# EAGLE design qpot (EAGLE 6.6.0)
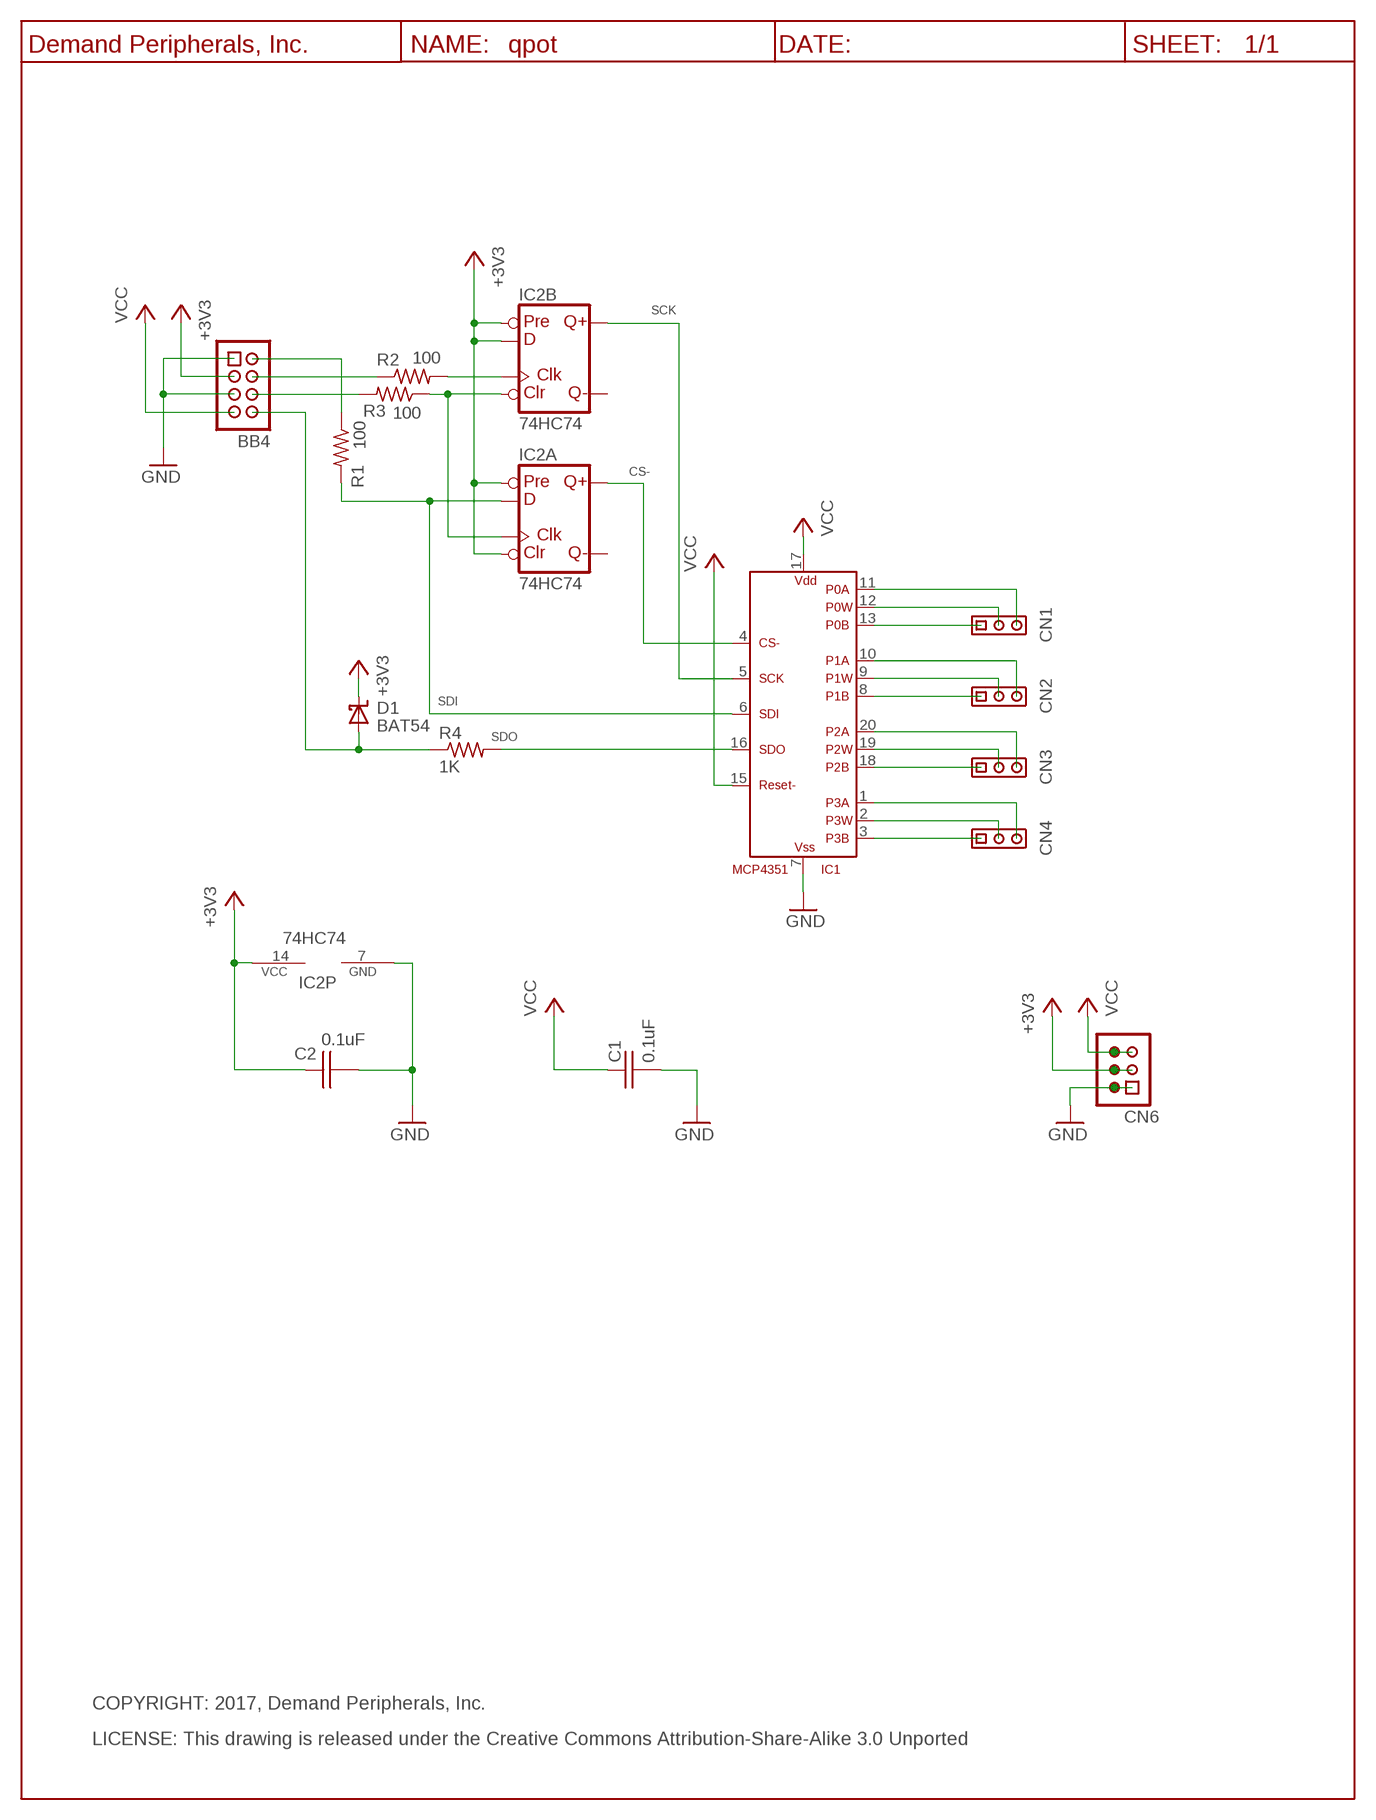
[diagram p0: schematic, sheet 1]

## Parts
BB4  BB_CON  HDR-4X2-SHR  [HDR-4X2]
C1  0.1uF  C0.1UF_C0603  [C0603]
C2  0.1uF  C0.1UF_C0603  [C0603]
CN1  HDR-3X1  [HDR-3X1]
CN2  HDR-3X1  [HDR-3X1]
CN3  HDR-3X1  [HDR-3X1]
CN4  HDR-3X1  [HDR-3X1]
CN6  HDR-3X2  [HDR-3X2]
D1  BAT54  [SOT23]
IC1  MCP4351  [TSSOP20]
IC2  74HC74  74AHC74SS  [SO14]
R1  100  R100_R0603  [R0603]
R2  100  R100_R0603  [R0603]
R3  100  R100_R0603  [R0603]
R4  1K  R1K_R0603  [R0603]
U$3  DP_FRAME_P  [P_FRAME]

## Nets
+3V3: BB4.3 C2.1 CN6.3 CN6.4 D1.3(CC) IC2.1(A:CLR) IC2.4(A:PRE) IC2.10(B:PRE) IC2.12(B:D) IC2.14(P:VCC)
GND: BB4.1 BB4.5 C1.2 C2.2 CN6.1 CN6.2 IC1.7(VSS) IC2.7(P:GND)
N$1: CN1.1 IC1.13(P0B)
N$2: CN1.2 IC1.12(P0W)
N$3: CN1.3 IC1.11(P0A)
N$4: CN2.1 IC1.8(P1B)
N$5: CN2.2 IC1.9(P1W)
N$6: CN2.3 IC1.10(P1A)
N$7: BB4.8 D1.1(A) R4.1
N$8: IC1.16(SDO) R4.2
N$13: IC2.3(A:CLK) IC2.13(B:CLR) R3.1
N$14: BB4.4 R2.1
N$15: IC1.6(SDI) IC2.2(A:D) R1.2
N$16: IC2.11(B:CLK) R2.2
N$17: CN3.1 IC1.18(P2B)
N$18: CN3.2 IC1.19(P2W)
N$19: BB4.6 R3.2
N$20: BB4.2 R1.1
N$21: CN3.3 IC1.20(P2A)
N$22: CN4.1 IC1.3(P3B)
N$23: IC1.4(CS-) IC2.5(A:Q)
N$24: IC1.5(SCK) IC2.9(B:Q)
N$25: CN4.2 IC1.2(P3W)
N$26: CN4.3 IC1.1(P3A)
VCC: BB4.7 C1.1 CN6.5 CN6.6 IC1.15(RESET-) IC1.17(VDD)
Unconnected: IC2.6(A:!Q) IC2.8(B:!Q)

## Notes on the sheet
- SCK
- CS-
- SDI
- SDO
- COPYRIGHT: 2017, Demand Peripherals, Inc.
- LICENSE: This drawing is released under the Creative Commons Attribution-Share-Alike 3.0 Unported

## Library data of the parts
BB4 = dpi-conn:HDR-4X2-SHR: Shrouded 4x2 pin header; VENDOR: Digikey; VENDOR-PART-NUM: 609-3530-ND
C1 C2 = dpi-passive:C0.1UF_: 0.1 uF Capacitor, 25V, X7R; VENDOR: Digikey; VENDOR-PART-NUM: 1276-1126-2-ND
CN1-CN4 = dpi-conn:HDR-3X1: 3 pin header on 0.1 inch centers, no shroud, no lock; VENDOR: Digikey; VENDOR-PART-NUM: 952-2264-ND
CN6 = dpi-conn:HDR-3X2: Unshrouded 3x2 header with 0.1 inch pitch; VENDOR: Digikey; VENDOR-PART-NUM: 952-2120-ND
D1 = dpi-diopto:BAT54: Schottky Diode; VENDOR: Digikey; VENDOR-PART-NUM: DB3Y313KELCT-ND
IC1 = dpi-transic:MCP4351: MCP5351: Quad 257 position 10K digital potentiometer; VENDOR: Digikey; VENDOR-PART-NUM: MCP4351-103E/ST-ND
IC2 = dpi-transic:74AHC74: Dual D type positive edge triggered FLIP FLOP, preset and clear; VENDOR: Digikey; VENDOR-PART-NUM: 568-4458-1-ND
R1-R3 = dpi-passive:R100_: 100 Ohm resistor, 1%, 0.1 watt; VENDOR: Digikey; VENDOR-PART-NUM: 311-100HRTR-ND
R4 = dpi-passive:R1K_: 1K Resistor, 1%, 0.1 watt; VENDOR: Digikey; VENDOR-PART-NUM: 311-1.00KHRTR-ND
U$3 = dpi-sym:DP_FRAME_P: Portrait/Letter Document Frame

## Board
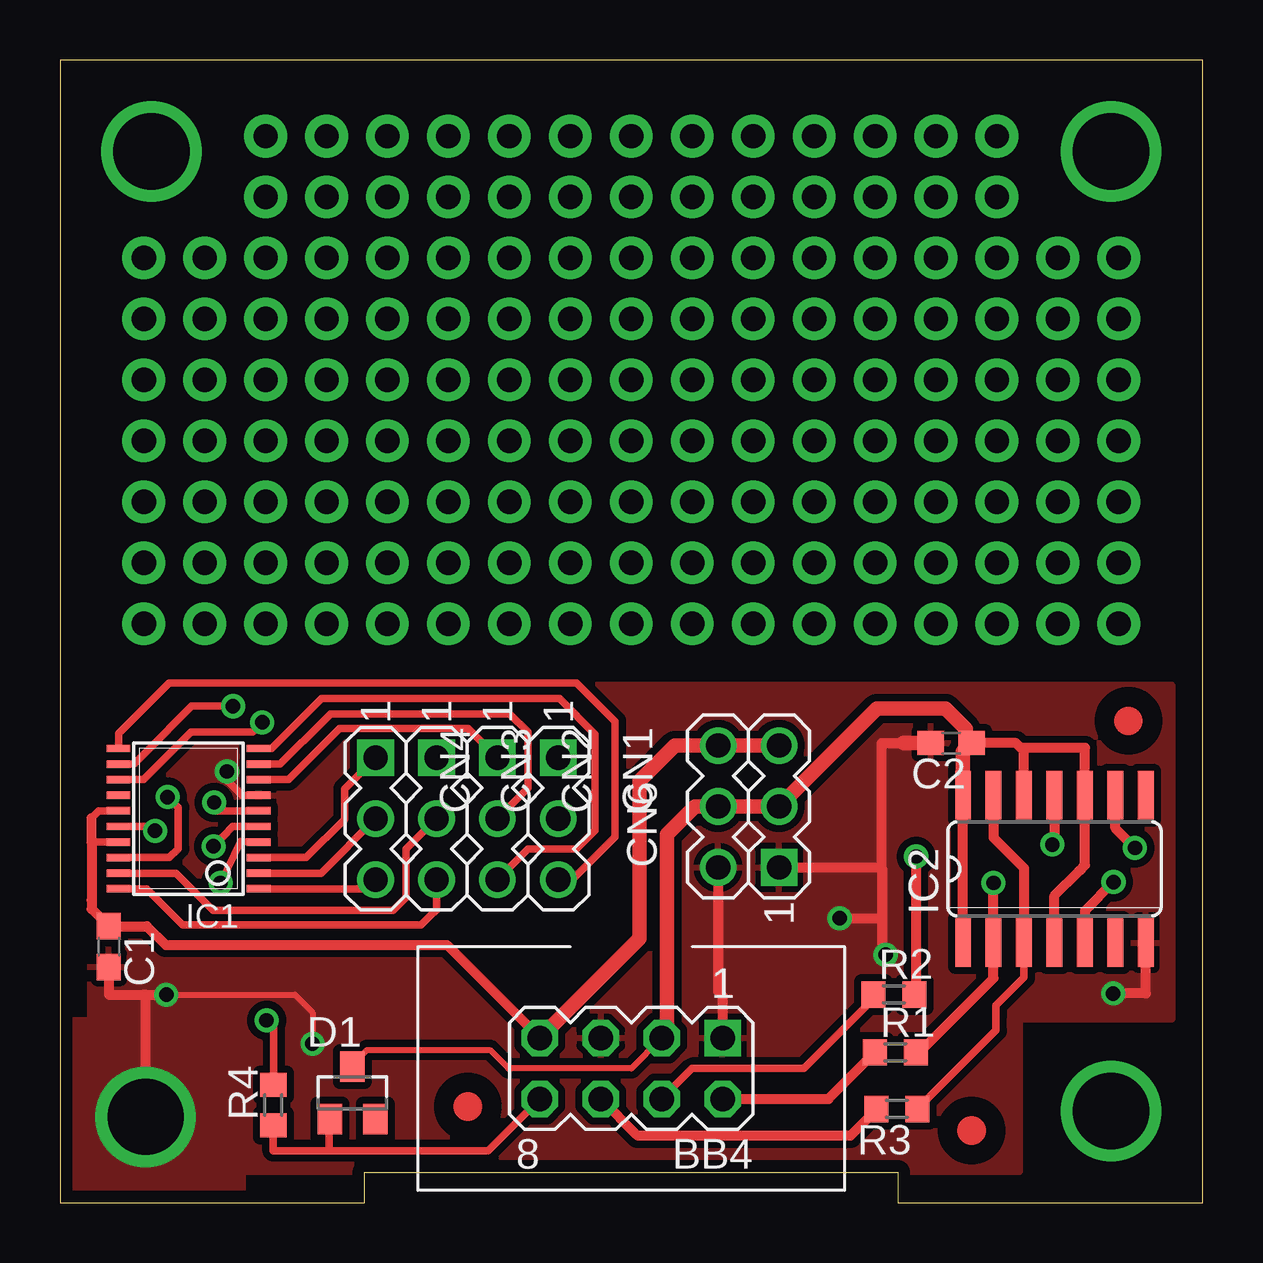
[diagram p1: board, top side]
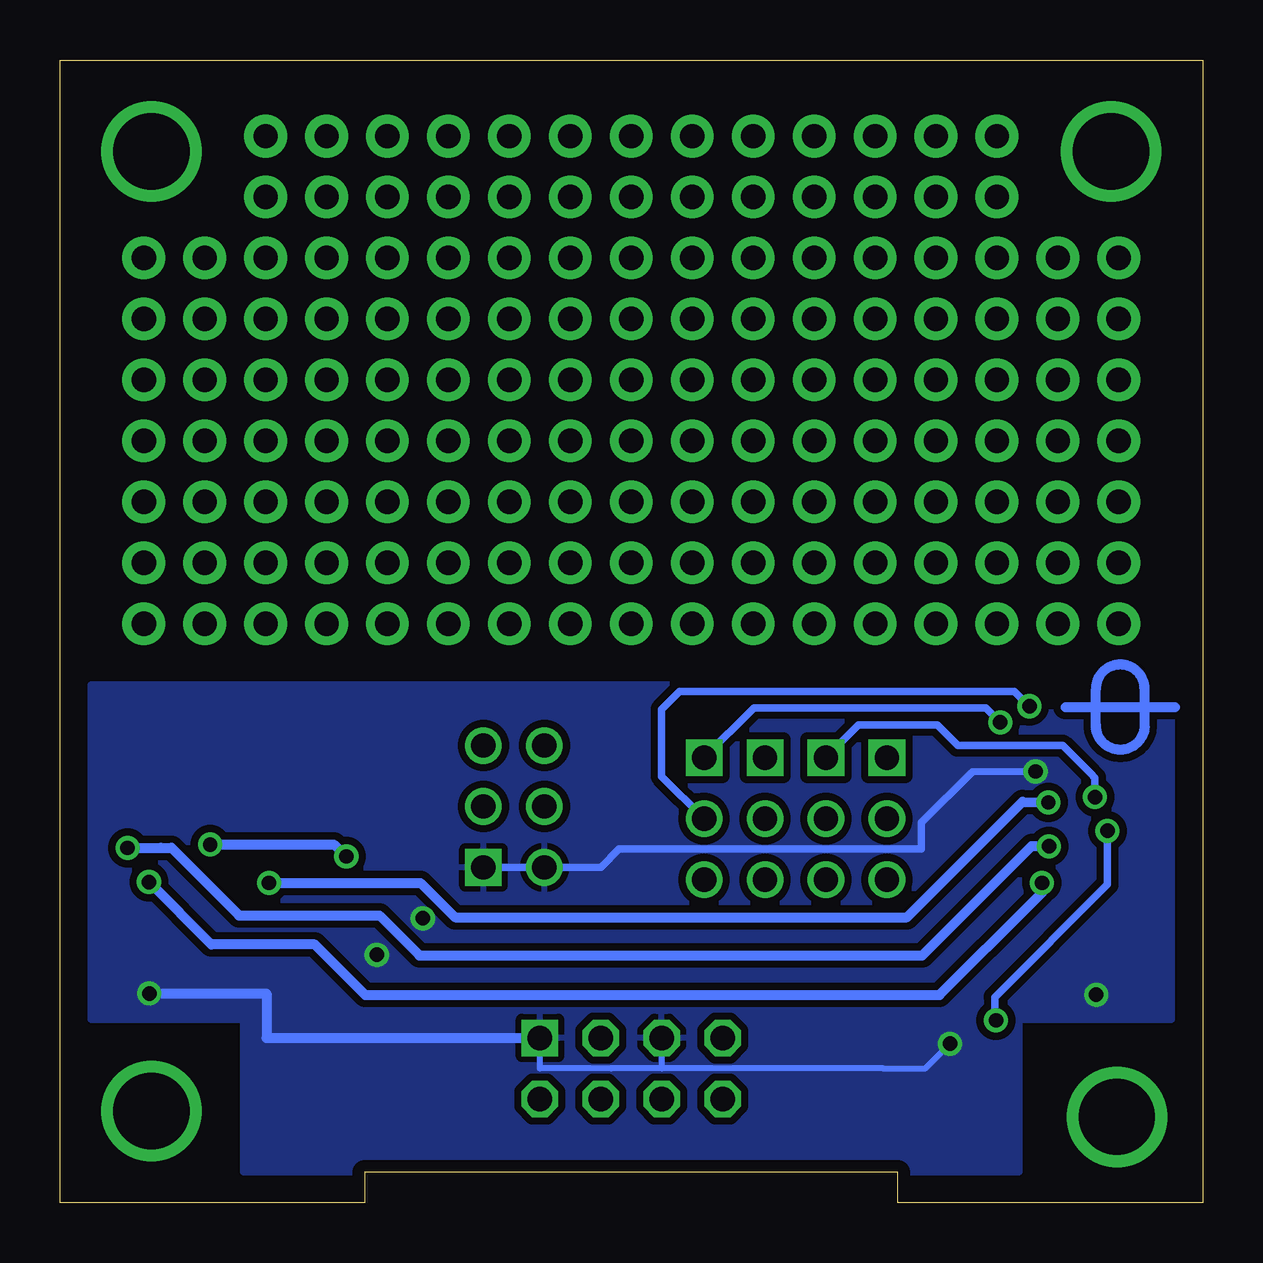
[diagram p2: board, bottom side, seen from below]

Size 47.62 x 47.62 mm. Coordinates in mm from the lower left corner, seen from the top.
Outline: 0,0 12.7,0 12.7,1.27 34.92,1.27 34.92,0 47.62,0 47.62,47.62 0,47.62 0,0
Copper layers (1*16): Top 0.035mm / dielectric 1.5mm / Bottom 0.035mm
Design rules "default *": minimum track width 10mil, minimum drill 20mil, track to track 12mil, track to pad 12mil, pad to pad 12mil, via to via 12mil, smd to smd 10mil, copper to edge 20mil, drill to drill 12mil, minimum pad ring 10mil, minimum via ring 8mil, stop-mask expansion 4mil, vias tented up to drill 30mil, thermal gap 10mil
tKeepout: area 15.1,1 to 32.5,9.7

### Footprints (pad centres in the part's own frame; a part is rotated, then mirrored left to right if it is on the bottom)
HDR-4X2 = drill 1.016 square: 1 -3.81,-1.27 | drill 1.016 octagon: 2 -3.81,1.27; 3 -1.27,-1.27; 4 -1.27,1.27; 5 1.27,-1.27; 6 1.27,1.27; 7 3.81,-1.27; 8 3.81,1.27
C0603 = smd 1.1 x 1: 1 -0.85,0; 2 0.85,0
HDR-3X1 = drill 1.016 square: 1 -2.54,0 | drill 1.016: 2 0,0; 3 2.54,0
HDR-3X2 = drill 1.016 square: 1 -2.54,-1.27 | drill 1.016: 2 -2.54,1.27; 3 0,-1.27; 4 0,1.27; 5 2.54,-1.27; 6 2.54,1.27
SOT23 = smd 1.016 x 1.27: 1 -0.95,-1.1; 2 0.95,-1.1; 3 0,1.1
TSSOP20 = smd 0.305 x 0.991: 1 -2.925,-2.918; 2 -2.275,-2.918; 3 -1.625,-2.918; 4 -0.975,-2.918; 5 -0.325,-2.918; 6 0.325,-2.918; 7 0.975,-2.918; 8 1.625,-2.918; 9 2.275,-2.918; 10 2.925,-2.918; 11 2.925,2.918; 12 2.275,2.918; 13 1.625,2.918; 14 0.975,2.918; 15 0.325,2.918; 16 -0.325,2.918; 17 -0.975,2.918; 18 -1.625,2.918; 19 -2.275,2.918; 20 -2.925,2.918
SO14 = smd 0.66 x 2.032: 1 -3.81,-3.073; 2 -2.54,-3.073; 3 -1.27,-3.073; 4 0,-3.073; 5 1.27,-3.073; 6 2.54,-3.073; 7 3.81,-3.073; 8 3.81,3.073; 9 2.54,3.073; 10 1.27,3.073; 11 0,3.073; 12 -1.27,3.073; 13 -2.54,3.073; 14 -3.81,3.073
R0603 = smd 1 x 1.1: 1 -0.85,0; 2 0.85,0

### Placement (x,y rotation side)
BB4  23.81,5.59 180 top
C1  2.03,10.67 270 top
C2  37.15,19.15 180 top
CN1  20.78,16 270 top
CN2  18.24,16 270 top
CN3  15.7,16 270 top
CN4  13.16,16 270 top
CN6  28.7,16.51 90 top
D1  12.19,4.57 0 top
IC1  5.36,16 90 top
IC2  41.45,13.91 0 top
R1  34.83,6.26 0 top
R2  34.76,8.67 0 top
R3  34.89,3.9 180 top
R4  8.89,4.06 90 top
U$1  [DPI-1]  3.43,20.65 90 bottom
U$3  -2.54,-2.54 0 top
U$4  [FIDUCIAL]  44.54,20.08 0 top
U$5  [FIDUCIAL]  17,4 0 top
U$6  [FIDUCIAL]  38,3 0 top

### Tracks (layer width: path | path; a pad name or v marks a point on that pad's centre or on a via)
+3V3
  Top 0.254: BB4.3 23.81,5.59 18.82,5.59 18.69,5.59 17.92,6.36 12.8,6.36 12.19,5.75 | 12.45,5.59 D1.3
  Top 0.305: 12.19,5.75 D1.3
  Top 0.406: 40.06,18.95 42.72,18.95 IC2.10 42.72,14.07 42.48,13.83 41.45,12.8 IC2.4 | IC2.12 40.18,18.82 40.06,18.95 | IC2.1 IC2.14 | 40.06,18.95 39.85,19.15 C2.1
  Top 0.61: BB4.3 25.3,7.07 25.3,15.34 26.47,16.51 CN6.4 CN6.3 34.06,20.6 36.54,20.6 36.91,20.6 37.77,19.74 37.77,19.38 C2.1 37.64,18.8 IC2.14
GND  (via drill 0.6, 3.17)
  Top 0.254: v4.43,8.66 9.79,8.66 10.17,8.28 10.53,7.92 v10.53,6.62
  Top 0.305: IC1.7 7.58,16.98 7.26,17.3 6.78,17.78 v6.96,17.97
  Top 0.406: v43.9,8.71 45.26,8.71 IC2.7 | C1.2 2.03,8.66 3.5,8.66 | 3.5,8.66 v4.43,8.66 | v3.57,3.57 3.57,8.66 3.5,8.66 | 34.25,14.06 34.25,13.97 34.25,11.82 | 34.25,14.06 34.25,19.15 35.15,19.15 | CN6.2 27.43,8.79 27.62,8.6 BB4.1 | 34.25,11.82 34.25,10.49 v34.42,10.32 | v32.5,11.85 34.23,11.85 34.25,11.82 | CN6.1 34.16,13.97 34.25,14.06
  Top 0.61: C2.2 35.15,19.15
  Bottom 0.254: BB4.5 22.54,5.59 | 22.54,5.59 24.64,5.59 27.62,5.59 BB4.1 | 22.54,5.59 13.31,5.59 11.56,5.59 v10.53,6.62
  Bottom 0.305: CN6.1 CN6.2 25.08,13.97 24.32,14.73 11.72,14.73 11.72,15.84 9.6,17.96 v6.96,17.97
  Bottom 0.406: v43.9,8.71 39.01,8.71 39.01,6.86 BB4.1
  pour Top: 1.27,21.59 46.35,21.59 46.35,7.62 40.01,7.62 40.01,1.27 7.62,1.27 7.62,0.51 0.51,0.51 0.51,7.62 1.27,7.62
  pour Bottom: 1.27,21.59 46.35,21.59 46.35,7.62 40.01,7.62 40.01,1.27 7.62,1.27 7.62,7.62 1.27,7.62
MOUNT  (via drill 3.17 pad 3.17)
  other vias: 43.81,43.81
N$1  (via drill 0.6)
  Top 0.305: v8.43,20.02 8.03,19.61 5.46,19.61 3.48,17.63 IC1.13
  Bottom 0.305: v8.43,20.02 9.03,20.61 18.71,20.61 CN1.1
N$2  (via drill 0.6)
  Top 0.305: v7.21,20.69 5.87,20.69 5.5,20.69 3.54,18.73 3.09,18.28 IC1.12
  Bottom 0.305: CN1.2 22.54,17.77 22.54,18.19 22.54,20.56 21.79,21.31 7.84,21.31 v7.21,20.69
N$3
  Top 0.305: CN1.3 21.36,13.46 23.14,15.24 23.14,20.05 21.53,21.67 5.79,21.67 4.55,21.67 2.44,19.56 IC1.11
N$4
  Top 0.305: CN2.1 17.02,19.76 13.98,19.76 12.15,19.76 11.66,19.76 11.34,19.44 9.52,17.63 IC1.8
N$5
  Top 0.305: 19.49,19.62 19.51,19.61 | 19.51,19.61 19.51,17.27 CN2.2 | 19.51,19.61 18.75,20.37 13.58,20.37 11.81,20.37 11.28,20.37 11.05,20.14 9.18,18.28 IC1.9
N$6
  Top 0.305: IC1.10 8.82,18.93 10.9,21.01 11.42,21.01 12.76,21.01 20.82,21.01 22.3,19.52 22.3,15.51 21.53,14.73 19.51,14.73 CN2.3
N$7
  Top 0.305: BB4.8 17.84,2.16 11.82,2.16 11.23,2.16 | 11.23,2.16 8.89,2.16 R4.1 | D1.1 11.23,3.47 11.23,2.16
N$8  (via drill 0.6)
  Top 0.305: IC1.16 3.78,15.68 v3.96,15.49 | v8.61,7.59 8.9,7.59 8.9,6.86 8.9,4.93 R4.2
  Bottom 0.305: v3.96,15.49 3.96,13.26 8.66,8.56 8.66,7.87 v8.61,7.59
N$13
  Top 0.305: R3.1 39.01,7.18 39.01,7.8 39.01,8.22 40.09,9.3 40.18,9.38 IC2.3
  Top 0.406: IC2.13 38.91,15.21 39.83,14.3 40.18,13.95 IC2.3
N$14
  Top 0.305: R2.1 33.91,8.5 31,5.59 26.92,5.59 26.35,5.59 BB4.4
N$15  (via drill 0.6)
  Top 0.305: IC1.6 6.48,16.33 v6.43,16.68
  Top 0.406: R1.2 35.68,6.43 35.99,6.43 38.91,9.35 IC2.2 v38.91,13.32
  Bottom 0.406: v38.91,13.32 32.6,13.32 31.17,11.89 12.32,11.89 7.51,16.7 v6.43,16.68
N$16  (via drill 0.6)
  Top 0.406: IC2.11 41.45,15.01 v41.36,14.92 | v35.69,14.43 35.69,8.75 R2.2
  Bottom 0.406: v41.36,14.92 36.21,14.92 v35.69,14.43
N$17  (via drill 0.6)
  Top 0.305: IC1.18 4.56,14.38 4.93,14.74 4.93,16.46 v4.48,16.9
  Bottom 0.305: CN3.1 14.34,19.9 11.05,19.9 10.97,19.82 10.45,19.3 10.2,19.05 5.83,19.05 4.66,17.88 4.48,17.7 v4.48,16.9
N$18
  Top 0.305: CN3.2 14.43,14.73 14.43,12.71 13.89,12.18 13.5,12.18 6.39,12.18 4.84,13.73 IC1.19
N$19
  Top 0.305: 34.04,3.86 R3.2
  Top 0.406: 34.04,3.86 32.96,2.78 24.08,2.78 BB4.6
N$20
  Top 0.406: BB4.2 32.03,4.32 R1.1
N$21
  Top 0.305: IC1.20 3.61,13.08 5.12,11.57 15.06,11.57 15.39,11.9 15.7,12.21 CN3.3
N$22
  Top 0.305: IC1.3 9.53,14.38 10.26,14.38 11.86,15.98 11.86,17.25 CN4.1
N$23  (via drill 0.6)
  Top 0.305: IC1.4 7.53,15.05 v6.69,13.32
  Top 0.406: v43.92,13.36 42.72,12.17 IC2.5
  Bottom 0.406: v43.92,13.36 41.31,10.76 37.01,10.76 34.9,8.65 16.56,8.65 11.93,8.65 10.96,8.65 7.06,12.55 6.69,12.92 v6.69,13.32
N$24  (via drill 0.6)
  Top 0.305: IC1.5 7.21,15.68 v6.4,14.85
  Top 0.406: v44.81,14.78 43.99,15.6 IC2.9
  Bottom 0.406: v44.81,14.78 43.42,14.78 42.98,14.78 40.37,12.18 40.16,11.96 34.3,11.96 32.64,10.3 25.57,10.3 11.68,10.3 7.12,14.86 6.41,14.86 v6.4,14.85
N$25
  Top 0.305: IC1.2 10.88,13.73 CN4.2
N$26
  Top 0.305: IC1.1 12.77,13.08 CN4.3
N$46  (via drill 3.17 pad 3.17)
  other vias: 43.81,3.81
N$47  (via drill 3.17 pad 3.17)
  other vias: 3.81,43.81
VCC
  Top 0.305: 1.32,16.03 1.62,16.33 IC1.15 | IC1.17 1.34,15.03 1.32,15.01
  Top 0.406: 1.32,16.03 1.32,15.01 1.32,12.61 1.32,12.23 C1.1 3.62,11.52 4.41,10.73 10.77,10.73 | 10.73,10.73 10.77,10.73 | 10.77,10.73 11.68,10.73 16.13,10.73 BB4.7
  Top 0.61: BB4.7 24.16,11.01 24.16,17.56 25.64,19.05 CN6.6 CN6.5
WW3  (via drill 1.02 pad 1.78)
  other vias: 3.49,24.13
WW4  (via drill 1.02 pad 1.78)
  other vias: 6.03,29.21
WW5  (via drill 1.02 pad 1.78)
  other vias: 3.49,31.75
WW6  (via drill 1.02 pad 1.78)
  other vias: 3.49,34.29
WW7  (via drill 1.02 pad 1.78)
  other vias: 3.49,36.83
WW8  (via drill 1.02 pad 1.78)
  other vias: 3.49,39.37
WW9  (via drill 1.02 pad 1.78)
  other vias: 3.49,26.67
WW10  (via drill 1.02 pad 1.78)
  other vias: 3.49,29.21
WW13  (via drill 1.02 pad 1.78)
  other vias: 8.57,24.13
WW14  (via drill 1.02 pad 1.78)
  other vias: 8.57,26.67
WW15  (via drill 1.02 pad 1.78)
  other vias: 11.11,26.67
WW16  (via drill 1.02 pad 1.78)
  other vias: 6.03,31.75
WW17  (via drill 1.02 pad 1.78)
  other vias: 6.03,34.29
WW18  (via drill 1.02 pad 1.78)
  other vias: 6.03,36.83
WW19  (via drill 1.02 pad 1.78)
  other vias: 6.03,39.37
WW20  (via drill 1.02 pad 1.78)
  other vias: 11.11,29.21
WW25  (via drill 1.02 pad 1.78)
  other vias: 6.03,24.13
WW26  (via drill 1.02 pad 1.78)
  other vias: 6.03,26.67
WW27  (via drill 1.02 pad 1.78)
  other vias: 8.57,31.75
WW28  (via drill 1.02 pad 1.78)
  other vias: 8.57,34.29
WW29  (via drill 1.02 pad 1.78)
  other vias: 8.57,36.83
WW30  (via drill 1.02 pad 1.78)
  other vias: 8.57,39.37
WW31  (via drill 1.02 pad 1.78)
  other vias: 8.57,41.91
WW32  (via drill 1.02 pad 1.78)
  other vias: 8.57,44.45
WW33  (via drill 1.02 pad 1.78)
  other vias: 13.65,24.13
WW34  (via drill 1.02 pad 1.78)
  other vias: 16.19,24.13
WW35  (via drill 1.02 pad 1.78)
  other vias: 16.19,26.67
WW36  (via drill 1.02 pad 1.78)
  other vias: 16.19,29.21
WW38  (via drill 1.02 pad 1.78)
  other vias: 11.11,31.75
WW39  (via drill 1.02 pad 1.78)
  other vias: 11.11,34.29
WW40  (via drill 1.02 pad 1.78)
  other vias: 11.11,36.83
WW41  (via drill 1.02 pad 1.78)
  other vias: 11.11,39.37
WW42  (via drill 1.02 pad 1.78)
  other vias: 11.11,41.91
WW43  (via drill 1.02 pad 1.78)
  other vias: 11.11,44.45
WW44  (via drill 1.02 pad 1.78)
  other vias: 8.57,29.21
WW47  (via drill 1.02 pad 1.78)
  other vias: 21.27,24.13
WW48  (via drill 1.02 pad 1.78)
  other vias: 21.27,26.67
WW49  (via drill 1.02 pad 1.78)
  other vias: 13.65,31.75
WW50  (via drill 1.02 pad 1.78)
  other vias: 13.65,34.29
WW51  (via drill 1.02 pad 1.78)
  other vias: 13.65,36.83
WW52  (via drill 1.02 pad 1.78)
  other vias: 13.65,39.37
WW53  (via drill 1.02 pad 1.78)
  other vias: 13.65,41.91
WW54  (via drill 1.02 pad 1.78)
  other vias: 13.65,44.45
WW55  (via drill 1.02 pad 1.78)
  other vias: 21.27,29.21
WW59  (via drill 1.02 pad 1.78)
  other vias: 11.11,24.13
WW60  (via drill 1.02 pad 1.78)
  other vias: 16.19,31.75
WW61  (via drill 1.02 pad 1.78)
  other vias: 16.19,34.29
WW62  (via drill 1.02 pad 1.78)
  other vias: 16.19,36.83
WW63  (via drill 1.02 pad 1.78)
  other vias: 16.19,39.37
WW64  (via drill 1.02 pad 1.78)
  other vias: 16.19,41.91
WW65  (via drill 1.02 pad 1.78)
  other vias: 16.19,44.45
WW68  (via drill 1.02 pad 1.78)
  other vias: 26.35,24.13
WW69  (via drill 1.02 pad 1.78)
  other vias: 26.35,26.67
WW70  (via drill 1.02 pad 1.78)
  other vias: 26.35,29.21
WW71  (via drill 1.02 pad 1.78)
  other vias: 18.73,31.75
WW72  (via drill 1.02 pad 1.78)
  other vias: 18.73,34.29
WW73  (via drill 1.02 pad 1.78)
  other vias: 18.73,36.83
WW74  (via drill 1.02 pad 1.78)
  other vias: 18.73,39.37
WW75  (via drill 1.02 pad 1.78)
  other vias: 18.73,41.91
WW76  (via drill 1.02 pad 1.78)
  other vias: 18.73,44.45
WW77  (via drill 1.02 pad 1.78)
  other vias: 13.65,26.67
WW78  (via drill 1.02 pad 1.78)
  other vias: 13.65,29.21
WW82  (via drill 1.02 pad 1.78)
  other vias: 21.27,31.75
WW83  (via drill 1.02 pad 1.78)
  other vias: 21.27,34.29
WW84  (via drill 1.02 pad 1.78)
  other vias: 21.27,36.83
WW85  (via drill 1.02 pad 1.78)
  other vias: 21.27,39.37
WW86  (via drill 1.02 pad 1.78)
  other vias: 21.27,41.91
WW87  (via drill 1.02 pad 1.78)
  other vias: 21.27,44.45
WW93  (via drill 1.02 pad 1.78)
  other vias: 23.81,31.75
WW94  (via drill 1.02 pad 1.78)
  other vias: 23.81,34.29
WW95  (via drill 1.02 pad 1.78)
  other vias: 23.81,36.83
WW96  (via drill 1.02 pad 1.78)
  other vias: 23.81,39.37
WW97  (via drill 1.02 pad 1.78)
  other vias: 23.81,41.91
WW98  (via drill 1.02 pad 1.78)
  other vias: 23.81,44.45
WW104  (via drill 1.02 pad 1.78)
  other vias: 26.35,31.75
WW105  (via drill 1.02 pad 1.78)
  other vias: 26.35,34.29
WW106  (via drill 1.02 pad 1.78)
  other vias: 26.35,36.83
WW107  (via drill 1.02 pad 1.78)
  other vias: 26.35,39.37
WW108  (via drill 1.02 pad 1.78)
  other vias: 26.35,41.91
WW109  (via drill 1.02 pad 1.78)
  other vias: 26.35,44.45
WW110  (via drill 1.02 pad 1.78)
  other vias: 18.73,24.13
WW111  (via drill 1.02 pad 1.78)
  other vias: 18.73,26.67
WW112  (via drill 1.02 pad 1.78)
  other vias: 18.73,29.21
WW115  (via drill 1.02 pad 1.78)
  other vias: 28.89,31.75
WW116  (via drill 1.02 pad 1.78)
  other vias: 28.89,34.29
WW117  (via drill 1.02 pad 1.78)
  other vias: 28.89,36.83
WW118  (via drill 1.02 pad 1.78)
  other vias: 28.89,39.37
WW119  (via drill 1.02 pad 1.78)
  other vias: 28.89,41.91
WW120  (via drill 1.02 pad 1.78)
  other vias: 28.89,44.45
WW126  (via drill 1.02 pad 1.78)
  other vias: 31.43,31.75
WW127  (via drill 1.02 pad 1.78)
  other vias: 31.43,34.29
WW128  (via drill 1.02 pad 1.78)
  other vias: 31.43,36.83
WW129  (via drill 1.02 pad 1.78)
  other vias: 31.43,39.37
WW130  (via drill 1.02 pad 1.78)
  other vias: 31.43,41.91
WW131  (via drill 1.02 pad 1.78)
  other vias: 31.43,44.45
WW137  (via drill 1.02 pad 1.78)
  other vias: 33.97,31.75
WW138  (via drill 1.02 pad 1.78)
  other vias: 33.97,34.29
WW139  (via drill 1.02 pad 1.78)
  other vias: 33.97,36.83
WW140  (via drill 1.02 pad 1.78)
  other vias: 33.97,39.37
WW141  (via drill 1.02 pad 1.78)
  other vias: 33.97,41.91
WW142  (via drill 1.02 pad 1.78)
  other vias: 33.97,44.45
WW144  (via drill 1.02 pad 1.78)
  other vias: 23.81,24.13
WW145  (via drill 1.02 pad 1.78)
  other vias: 23.81,26.67
WW146  (via drill 1.02 pad 1.78)
  other vias: 23.81,29.21
WW148  (via drill 1.02 pad 1.78)
  other vias: 36.51,31.75
WW149  (via drill 1.02 pad 1.78)
  other vias: 36.51,34.29
WW150  (via drill 1.02 pad 1.78)
  other vias: 36.51,36.83
WW151  (via drill 1.02 pad 1.78)
  other vias: 36.51,39.37
WW152  (via drill 1.02 pad 1.78)
  other vias: 36.51,41.91
WW153  (via drill 1.02 pad 1.78)
  other vias: 36.51,44.45
WW159  (via drill 1.02 pad 1.78)
  other vias: 39.05,31.75
WW160  (via drill 1.02 pad 1.78)
  other vias: 39.05,34.29
WW161  (via drill 1.02 pad 1.78)
  other vias: 39.05,36.83
WW162  (via drill 1.02 pad 1.78)
  other vias: 39.05,39.37
WW163  (via drill 1.02 pad 1.78)
  other vias: 39.05,41.91
WW164  (via drill 1.02 pad 1.78)
  other vias: 39.05,44.45
WW170  (via drill 1.02 pad 1.78)
  other vias: 41.59,31.75
WW171  (via drill 1.02 pad 1.78)
  other vias: 41.59,34.29
WW172  (via drill 1.02 pad 1.78)
  other vias: 41.59,36.83
WW173  (via drill 1.02 pad 1.78)
  other vias: 41.59,39.37
WW178  (via drill 1.02 pad 1.78)
  other vias: 28.89,24.13
WW179  (via drill 1.02 pad 1.78)
  other vias: 28.89,26.67
WW180  (via drill 1.02 pad 1.78)
  other vias: 28.89,29.21
WW181  (via drill 1.02 pad 1.78)
  other vias: 44.13,31.75
WW182  (via drill 1.02 pad 1.78)
  other vias: 44.13,34.29
WW183  (via drill 1.02 pad 1.78)
  other vias: 44.13,36.83
WW184  (via drill 1.02 pad 1.78)
  other vias: 44.13,39.37
WW195  (via drill 1.02 pad 1.78)
  other vias: 31.43,24.13
WW196  (via drill 1.02 pad 1.78)
  other vias: 31.43,26.67
WW197  (via drill 1.02 pad 1.78)
  other vias: 31.43,29.21
WW212  (via drill 1.02 pad 1.78)
  other vias: 33.97,24.13
WW213  (via drill 1.02 pad 1.78)
  other vias: 33.97,26.67
WW214  (via drill 1.02 pad 1.78)
  other vias: 33.97,29.21
WW229  (via drill 1.02 pad 1.78)
  other vias: 36.51,24.13
WW230  (via drill 1.02 pad 1.78)
  other vias: 36.51,26.67
WW231  (via drill 1.02 pad 1.78)
  other vias: 36.51,29.21
WW246  (via drill 1.02 pad 1.78)
  other vias: 39.05,24.13
WW247  (via drill 1.02 pad 1.78)
  other vias: 39.05,26.67
WW248  (via drill 1.02 pad 1.78)
  other vias: 39.05,29.21
WW263  (via drill 1.02 pad 1.78)
  other vias: 41.59,24.13
WW264  (via drill 1.02 pad 1.78)
  other vias: 41.59,26.67
WW265  (via drill 1.02 pad 1.78)
  other vias: 41.59,29.21
WW280  (via drill 1.02 pad 1.78)
  other vias: 44.13,24.13
WW281  (via drill 1.02 pad 1.78)
  other vias: 44.13,26.67
WW282  (via drill 1.02 pad 1.78)
  other vias: 44.13,29.21

### Text on the board
tTest: 1.875 Inches | 1.575 Inches | (C) 2018, Demand Peripherals, Inc. | QPOT, Rev 18B | 4 | 3 | 2 | 1 | 5 | 5.0 | C2 | B | B | W | W | 3 | 3.3 | Gnd | 1.575 Inches | 1.875 Inches | A | A | G | IC1 | IC2 | C1 | BB4 | R2 | R1 | R4 | D1 | R3